# Altium schematic sheet Sheet2.SchDoc
size 420 x 297 mm; SheetNumber: 2; SheetTotal: 2
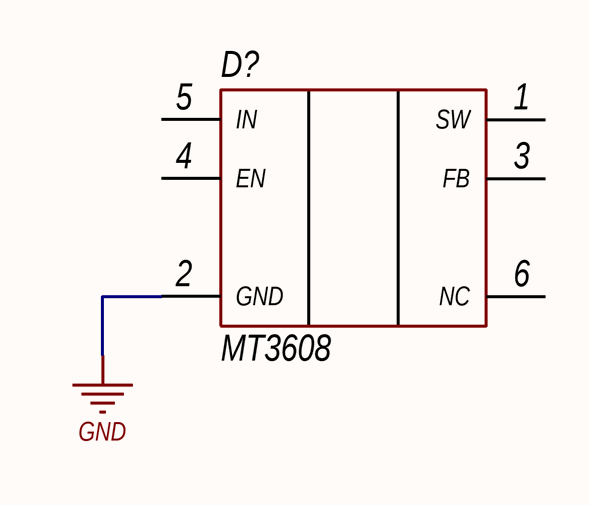
[diagram p0: Sheet2.SchDoc]

## Parts
D?  (no value)  [SOT23-6]

## Nets
GND: D?.2(GND)

Not connected (* = marked no-connect by the designer): D? 1(SW) 3(FB) 4(EN) 5(IN) 6(NC)

## Notes on the sheet
- Подп. и дата
- Инв. № дубл.
- Взам. инв. №
- Инв. № подл.
- Изм.
- Лист
- № докум.
- Подп.
- Дата
- 2.106-A3
- Копировал
- Формат А3

## Library data of the parts
D? = MT3608: Step Up Converter; HelpURL: https://www.olimex.com/Products/Breadboarding/BB-PWR-3608/resources/MT3608.pdf; Package: SOT23-6; ComponentType: High Efficiency 1.2MHz; ValueManufacturerPartNumber: =ComponentType+', '+VoltageInput+', '+MaxDropout+', '+VoltageOutput+', '+CurrentOutput+', '+Temperature+', '+Package; Temperature: -40...+85°C; PartNumber: MT3608